# EAGLE schematic etchasketch (EAGLE 9.6.2)
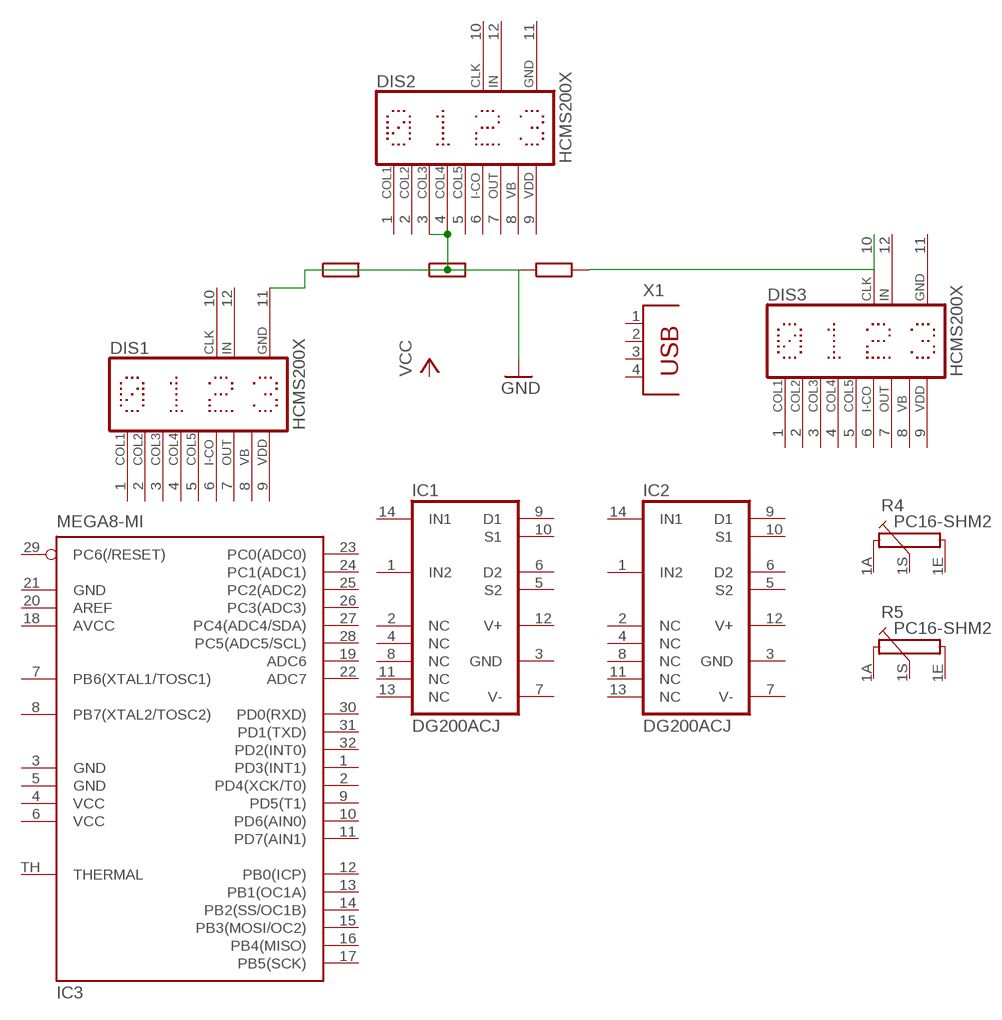
[diagram p0: schematic, sheet 1]

## Parts
DIS1  HCMS200X  [HCMS200X]
DIS2  HCMS200X  [HCMS200X]
DIS3  HCMS200X  [HCMS200X]
IC1  DG200ACJ  [DIL14]
IC2  DG200ACJ  [DIL14]
IC3  MEGA8-MI  [MLF32-TH]
R4  PC16-SHM2  [PC16-SHM2]
R5  PC16-SHM2  [PC16-SHM2]
X1  PN61729  [PN61729]

## Nets
GND: DIS1.11(GND) DIS2.3(COL3) DIS2.4(COL4)
N$2: DIS3.10(CLK)
Unconnected: DIS1.1(COL1) DIS1.2(COL2) DIS1.3(COL3) DIS1.4(COL4) DIS1.5(COL5) DIS1.6(I-CO) DIS1.7(OUT) DIS1.8(VB) DIS1.10(CLK) DIS1.12(IN) DIS2.1(COL1) DIS2.2(COL2) DIS2.5(COL5) DIS2.6(I-CO) DIS2.7(OUT) DIS2.8(VB) DIS2.10(CLK) DIS2.12(IN) DIS3.1(COL1) DIS3.2(COL2) DIS3.3(COL3) DIS3.4(COL4) DIS3.5(COL5) DIS3.6(I-CO) DIS3.7(OUT) DIS3.8(VB) DIS3.12(IN) IC1.1(IN2) IC1.2(NC) IC1.4(NC) IC1.5(S2) IC1.6(D2) IC1.8(NC) IC1.9(D1) IC1.10(S1) IC1.11(NC) IC1.13(NC) IC1.14(IN1) IC2.1(IN2) IC2.2(NC) IC2.4(NC) IC2.5(S2) IC2.6(D2) IC2.8(NC) IC2.9(D1) IC2.10(S1) IC2.11(NC) IC2.13(NC) IC2.14(IN1) IC3.1(PD3(INT1)) IC3.2(PD4(XCK/T0)) IC3.7(PB6(XTAL1/TOSC1)) IC3.8(PB7(XTAL2/TOSC2)) IC3.9(PD5(T1)) IC3.10(PD6(AIN0)) IC3.11(PD7(AIN1)) IC3.12(PB0(ICP)) IC3.13(PB1(OC1A)) IC3.14(PB2(SS/OC1B)) IC3.15(PB3(MOSI/OC2)) IC3.16(PB4(MISO)) IC3.17(PB5(SCK)) IC3.19(ADC6) IC3.20(AREF) IC3.22(ADC7) IC3.23(PC0(ADC0)) IC3.24(PC1(ADC1)) IC3.25(PC2(ADC2)) IC3.26(PC3(ADC3)) IC3.27(PC4(ADC4/SDA)) IC3.28(PC5(ADC5/SCL)) IC3.29(PC6(/RESET)) IC3.30(PD0(RXD)) IC3.31(PD1(TXD)) IC3.32(PD2(INT0)) IC3.TH(THERMAL) R4.1A R4.1E R4.1S R4.M1 R4.M2 R4.M3 R4.M4 R5.1A R5.1E R5.1S R5.M1 R5.M2 R5.M3 R5.M4 X1.1 X1.2 X1.3 X1.4

## Power pins joined to a net without a drawn wire
AVCC: IC3.18(AVCC)
GND: DIS2.11(GND) DIS3.11(GND) IC1.3(GND) IC2.3(GND) IC3.3(GND) IC3.5(GND) IC3.21(GND)
V+: IC1.12(V+) IC2.12(V+)
V-: IC1.7(V-) IC2.7(V-)
VCC: IC3.4(VCC) IC3.6(VCC)
VDD: DIS1.9(VDD) DIS2.9(VDD) DIS3.9(VDD)

## Library data of the parts
DIS1-DIS3 = display-hp:HCMS200X: LED DISPLAY 4-character dot matrix; OC_FARNELL: unknown; OC_NEWARK: unknown
IC1 IC2 = maxim:DG200ACJ: ANALOG SWITCH; OC_FARNELL: unknown; OC_NEWARK: 77C6395
IC3 = atmel:MEGA8-MI: MICROCONTROLLER 8 Kbytes FLASH, 1 kbytes SRAM, 512 bytes EEPROM, USART, 6-channel 10 bit ADC, 2-channel 8 bit ADC Pin compatible with Atmega48, ATMega88, ATMega168 Source: avr.lbr; MPN: ATMEGA88PA-MU; OC_FARNELL: 1715491; OC_NEWARK: 15R0272
R4 R5 = piher:PC16-SHM2: POTENTIOMETER single carbon potentiometer, 16 mm, S3ROH; OC_FARNELL: unknown; OC_NEWARK: unknown
X1 = con-berg:PN61729: BERG USB connector; OC_FARNELL: unknown; OC_NEWARK: unknown